# EAGLE design Natcar (EAGLE 8.3.2)
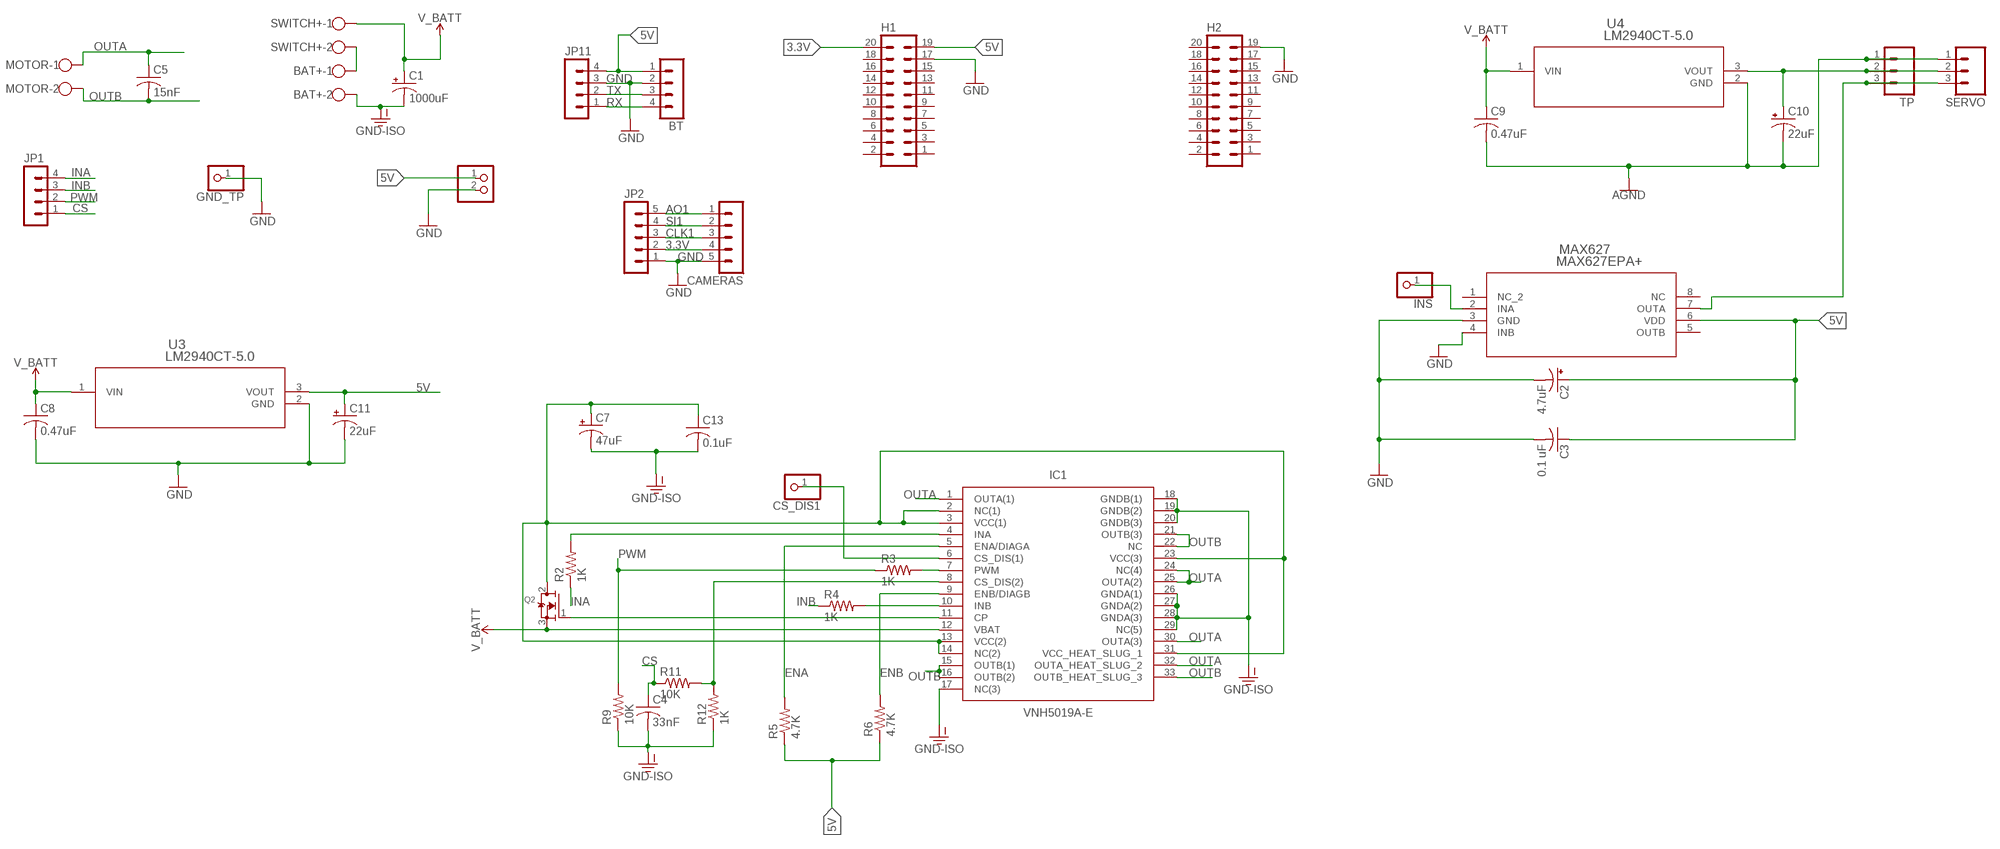
[diagram p0: schematic, sheet 1]

## Parts
BAT+  W237-102  [W237-102]
BT  MA04-1  [MA04-1]
C1  1000uF  CPOL-USE5-10.5  [E5-10,5]
C2  4.7uF  CPOL-USE2-5  [E2-5]
C3  0.1 uF  C-US025-030X050  [C025-030X050]
C4  33nF  C-US025-030X050  [C025-030X050]
C5  15nF  C-US025-030X050  [C025-030X050]
C7  47uF  CPOL-USE2.5-5  [E2,5-5]
C8  0.47uF  C-US025-030X050  [C025-030X050]
C9  0.47uF  C-US025-030X050  [C025-030X050]
C10  22uF  CPOL-USE2.5-5  [E2,5-5]
C11  22uF  CPOL-USE2.5-5  [E2,5-5]
C13  0.1uF  C-US025-030X050  [C025-030X050]
CAMERAS  MA05-1  [MA05-1]
CS_DIS1  PINHD-1X1  [1X01]
GND_TP  PINHD-1X1  [1X01]
H1  MA10-2  [MA10-2]
H2  MA10-2  [MA10-2]
IC1  VNH5019A-E  [VNH5019A-E_1]
INS  PINHD-1X1  [1X01]
JP1  MA04-1  [MA04-1]
JP2  MA05-1  [MA05-1]
JP11  MA04-1  [MA04-1]
JP12  PINHD-1X2  [1X02]
MAX627  MAX627EPA+  [21-0043D_8]
MOTOR  W237-102  [W237-102]
Q2  MOSFET-NGDS_TO220V  [TO220V]
R2  1K  R-US_0309/10  [0309/10]
R3  1K  R-US_0309/10  [0309/10]
R4  1K  R-US_0309/10  [0309/10]
R5  4.7K  R-US_0309/10  [0309/10]
R6  4.7K  R-US_0309/10  [0309/10]
R9  10K  R-US_0309/10  [0309/10]
R11  10K  R-US_0309/10  [0309/10]
R12  1K  R-US_0309/10  [0309/10]
SERVO  MA03  [03P]
SWITCH+  W237-102  [W237-102]
TP  MA03  [03P]
U3  LM2940CT-5.0  [T03B]
U4  LM2940CT-5.0  [T03B]

## Nets
3.3V: CAMERAS.4 H1.20 JP2.2
5V: BT.1 C2.+ C3.1 C11.+ H1.19 JP11.4 JP12.1 MAX627.6(VDD) R5.1 R6.1 U3.3(VOUT)
AGND: C9.2 C10.- SERVO.1 TP.1 U4.2(GND)
AO1: CAMERAS.1 JP2.5
CLK1: CAMERAS.3 JP2.3
CS: C4.1 JP1.1 R11.1
ENA: IC1.5(ENA/DIAGA) R5.2
ENB: IC1.9(ENB/DIAGB) R6.2
GND: BT.2 C2.- C3.2 C8.2 C11.- CAMERAS.5 GND_TP.1 H1.17 H2.19 JP2.1 JP11.3 JP12.2 MAX627.3(GND) MAX627.4(INB) U3.2(GND)
GND-ISO: BAT+.2 C1.- C4.2 C7.- C13.2 IC1.17(NC(3)) IC1.18(GNDB(1)) IC1.19(GNDB(2)) IC1.20(GNDB(3)) IC1.26(GNDA(1)) IC1.27(GNDA(2)) IC1.28(GNDA(3)) IC1.29(NC(5)) R9.1 R12.1
INA: JP1.4 R2.1
INB: JP1.3 R4.1
N$4: BAT+.1 SWITCH+.2
N$12: IC1.11(CP) Q2.1(G)
N$13: IC1.10(INB) R4.2
N$14: C7.+ C13.1 IC1.2(NC(1)) IC1.3(VCC(1)) IC1.13(VCC(2)) IC1.14(NC(2)) IC1.23(VCC(3)) IC1.31(VCC_HEAT_SLUG_1) Q2.2(D)
N$15: IC1.4(INA) R2.2
N$16: CS_DIS1.1 IC1.6(CS_DIS(1))
N$17: IC1.7(PWM) R3.2
N$20: INS.1 MAX627.2(INA)
N$21: MAX627.7(OUTA) SERVO.3 TP.3
N$22: IC1.8(CS_DIS(2)) R11.2 R12.2
N$70: C10.+ SERVO.2 TP.2 U4.3(VOUT)
OUTA: C5.1 IC1.1(OUTA(1)) IC1.24(NC(4)) IC1.25(OUTA(2)) IC1.30(OUTA(3)) IC1.32(OUTA_HEAT_SLUG_2) MOTOR.1
OUTB: C5.2 IC1.15(OUTB(1)) IC1.16(OUTB(2)) IC1.21(OUTB(3)) IC1.22(NC) IC1.33(OUTB_HEAT_SLUG_3) MOTOR.2
PWM: JP1.2 R3.1 R9.2
RX: BT.4 JP11.1
SI1: CAMERAS.2 JP2.4
TX: BT.3 JP11.2
V_BATT [Power]: C1.+ C8.1 C9.1 IC1.12(VBAT) Q2.3(S) SWITCH+.1 U3.1(VIN) U4.1(VIN)
Unconnected: H1.1 H1.2 H1.3 H1.4 H1.5 H1.6 H1.7 H1.8 H1.9 H1.10 H1.11 H1.12 H1.13 H1.14 H1.15 H1.16 H1.18 H2.1 H2.2 H2.3 H2.4 H2.5 H2.6 H2.7 H2.8 H2.9 H2.10 H2.11 H2.12 H2.13 H2.14 H2.15 H2.16 H2.17 H2.18 H2.20 MAX627.1(NC_2) MAX627.5(OUTB) MAX627.8(NC)

## Library data of the parts
BAT+ MOTOR SWITCH+ = con-wago-500:W237-102: WAGO SCREW CLAMP; MPN: 237-102; OC_FARNELL: unknown; OC_NEWARK: 70K9898
BT JP1 JP11 = con-lstb:MA04-1: PIN HEADER; OC_FARNELL: unknown; OC_NEWARK: unknown
C1 C2 C7 C10 C11 = adafruit:CPOL-US: POLARIZED CAPACITOR, American symbol
C3 = adafruit:C-US: CAPACITOR, American symbol
C4 C5 C8 C9 C13 = rcl:C-US: CAPACITOR, American symbol
CAMERAS JP2 = con-lstb:MA05-1: PIN HEADER; OC_FARNELL: unknown; OC_NEWARK: unknown
CS_DIS1 GND_TP INS = adafruit:PINHD-1X1: Pin header 1x1 for 0.1" spacing With round pins
H1 H2 = con-lstb:MA10-2: PIN HEADER; OC_FARNELL: unknown; OC_NEWARK: unknown
IC1 = VNH5019A-E:VNH5019A-E: H-Bridge Motor Driver 30A Auto PowerSO30 STMicroelectronics VNH5019A-E Motor Driver,, H-Bridge Motor Driver, 30-Pin MultiPowerSO <https://componentsearchengine.com/Images/1/VNH5019A-E.JPG> Source: Datasheet <http://docs-europe.electrocomponents.com/webdocs/140d/0900766b8140dac2.pdf>; DESCRIPTION: H-Bridge Motor Driver 30A Auto PowerSO30 STMicroelectronics VNH5019A-E Motor Driver,, H-Bridge Motor Driver, 30-Pin MultiPowerSO; HEIGHT: mm; MANUFACTURER_NAME: STMicroelectronics; MANUFACTURER_PART_NUMBER: VNH5019A-E; RS_PART_NUMBER: 8805550P; SUPPLIER_NAME: RS
JP12 = pinhead:PINHD-1X2: PIN HEADER
MAX627 = max627epa:MAX627EPA+; MANUFACTURER_PART_NUMBER: MAX627EPA+; VENDOR: Maxim Integrated Products
Q2 = adafruit:MOSFET-N: N-Channel Mosfet 2N7002E - 60V 260mA SOT23 [Digikey: 2N7002ET1GOSTR-ND] - REEL BSH103 - 30V 850mA SOT23 [Digikey: 568-5013-1-ND]
R2-R6 R9 R11 R12 = adafruit:R-US_: RESISTOR, American symbol
SERVO TP = con-amp-quick:MA03: AMP QUICK CONNECTOR; OC_FARNELL: unknown; OC_NEWARK: unknown
U3 U4 = lm2940ct:LM2940CT-5.0; MANUFACTURER_PART_NUMBER: LM2940CT5.0; VENDOR: Texas Instruments

## Net classes
0 Control: width 0.254 mm, drill 0.508 mm, clearance 0.305 mm
1 Power: width 0.508 mm, drill 0.508 mm, clearance 0.305 mm

## Board
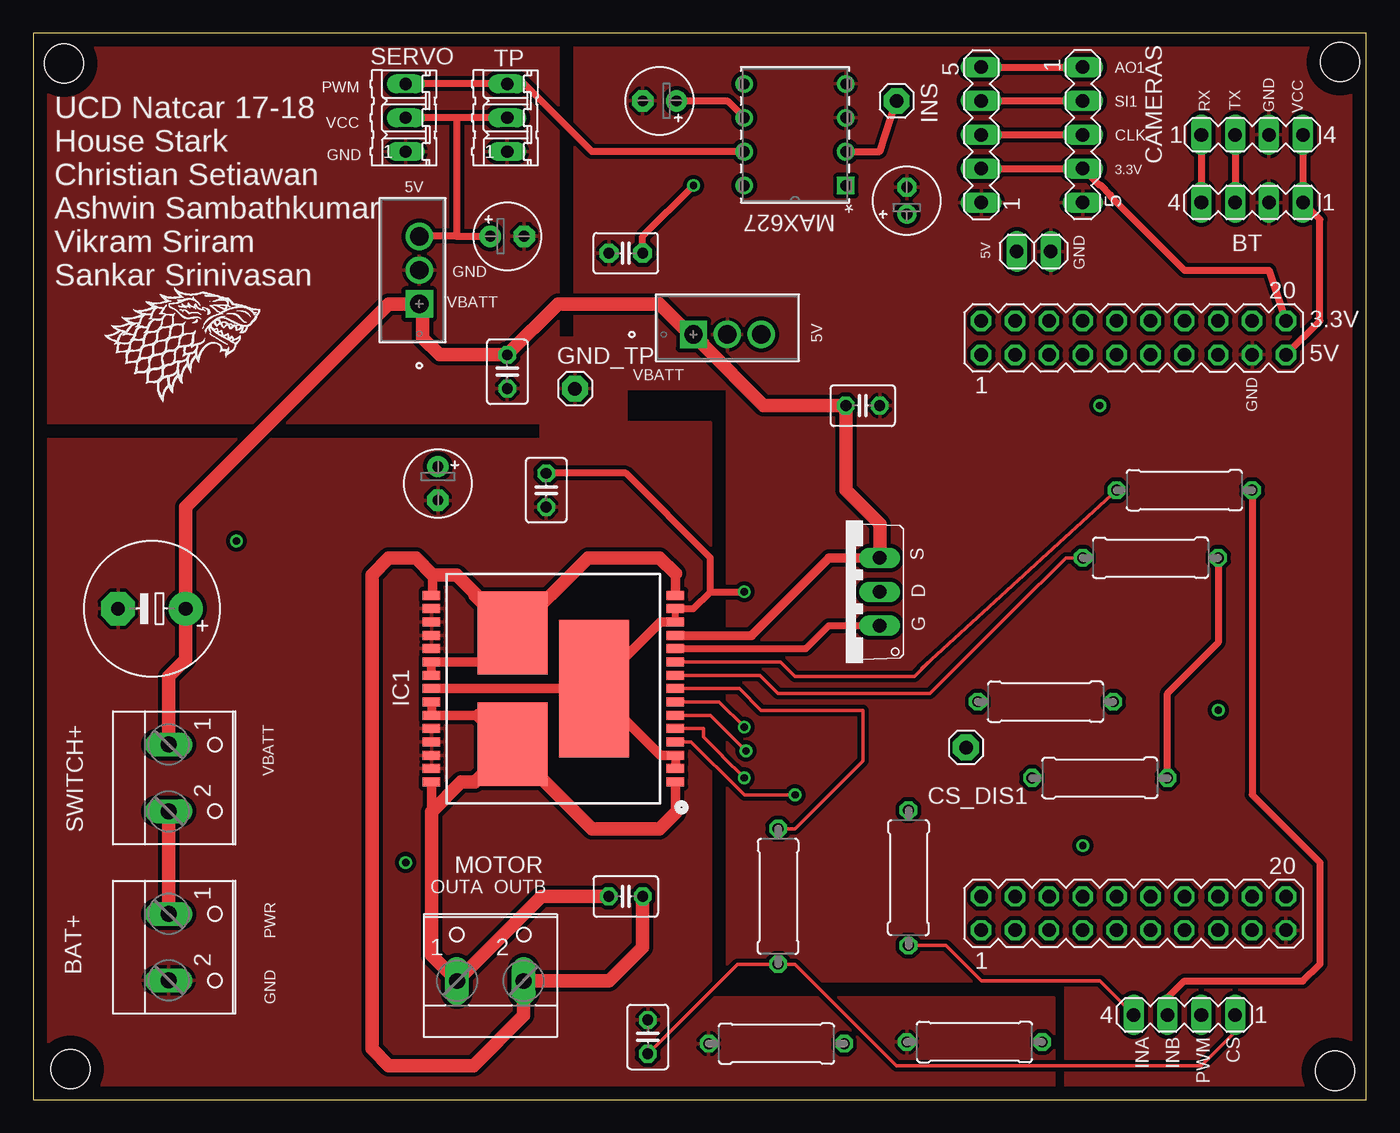
[diagram p1: board, top side]
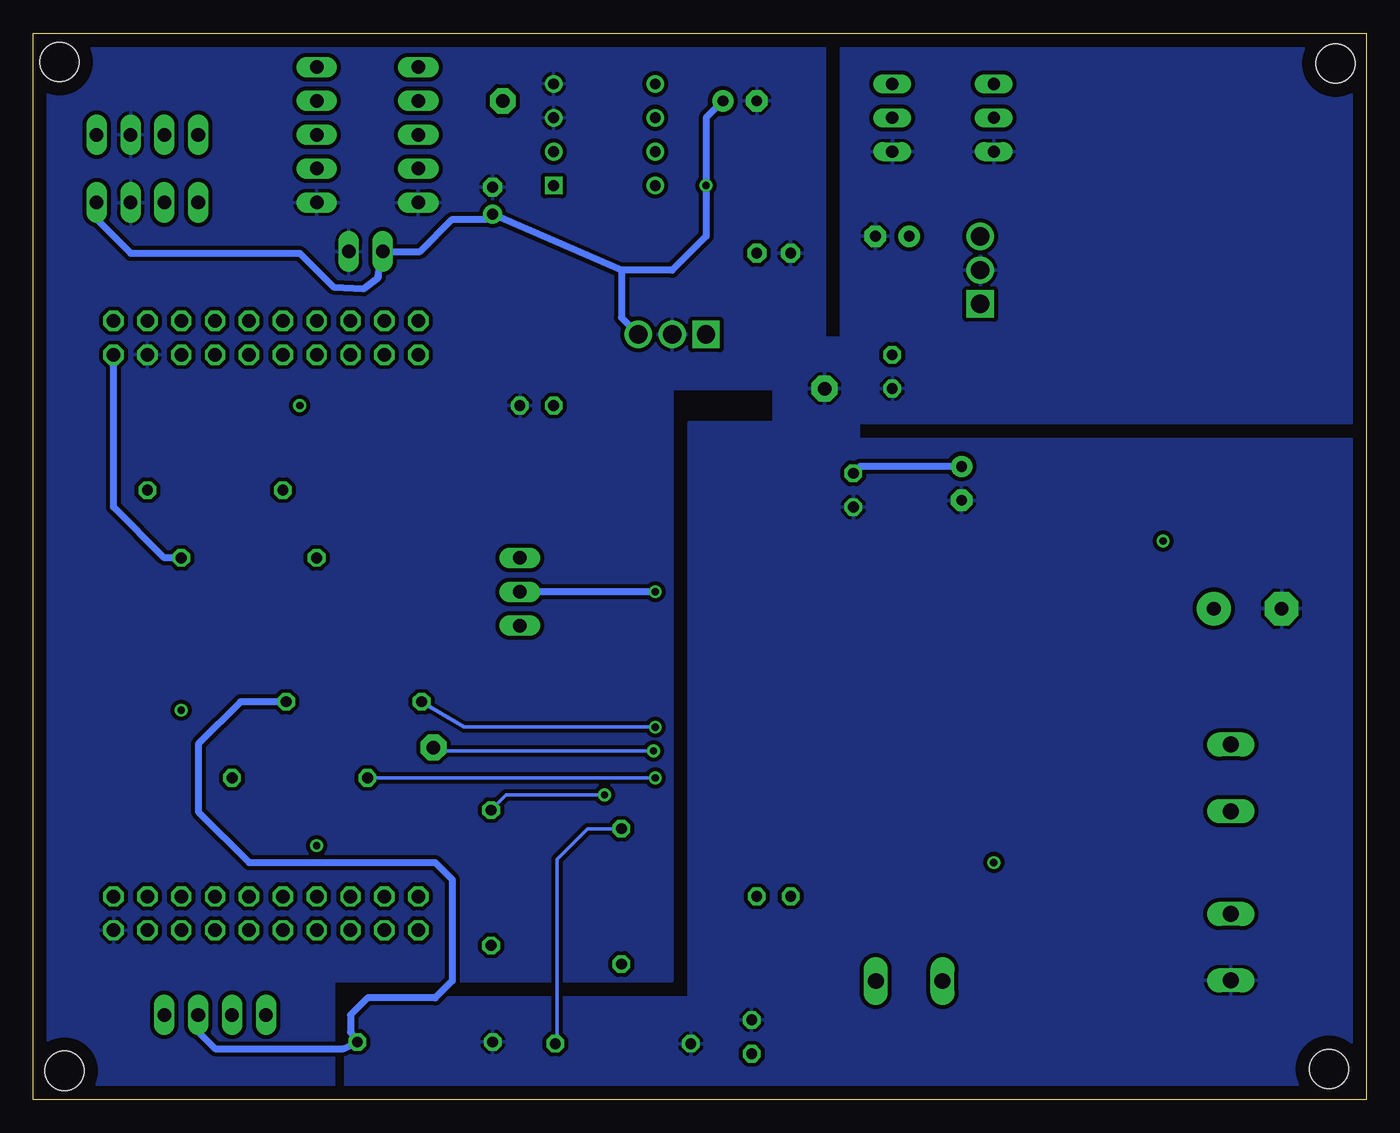
[diagram p2: board, bottom side, seen from below]

Size 100 x 80 mm. Coordinates in mm from the lower left corner, seen from the top.
Outline: 0,0 100,0 100,80 0,80 0,0
Copper layers (1*16): Top 0.035mm / dielectric 1.5mm / Bottom 0.035mm
Design rules "default *": minimum track width 10mil, minimum drill 0.35mm, track to track 6mil, track to pad 6mil, pad to pad 6mil, via to via 6mil, smd to smd 6mil, copper to edge 40mil, drill to drill 6mil, minimum pad ring 10mil, minimum via ring 8mil, stop-mask expansion 4mil, vias tented up to drill 0mil, thermal gap 10mil
Holes 2.95 mm at 2.29,77.72 2.79,2.29 98.04,77.85 97.66,2.16

### Footprints (pad centres in the part's own frame; a part is rotated, then mirrored left to right if it is on the bottom)
W237-102 = drill 1.194 long: 1 -2.5,-1.27; 2 2.5,-1.27
MA04-1 = drill 1.016 long: 1 -3.81,0; 2 -1.27,0; 3 1.27,0; 4 3.81,0
E5-10,5 = drill 1.016 pad 2.54: + -2.54,0 | drill 1.016 pad 2.54 octagon: - 2.54,0
E2-5 = drill 0.813 pad 1.422: + -1.016,0 | drill 0.813 pad 1.422 octagon: - 1.016,0
C025-030X050 = drill 0.813 pad 1.422 octagon: 1 -1.27,0; 2 1.27,0
C025-030X050' = drill 0.813 octagon: 1 -1.27,0; 2 1.27,0
E2,5-5 = drill 0.813 pad 1.6: + -1.27,0 | drill 0.813 pad 1.6 octagon: - 1.27,0
MA05-1 = drill 1.016 long: 1 -5.08,0; 2 -2.54,0; 3 0,0; 4 2.54,0; 5 5.08,0
1X01 = drill 1.016 pad 1.93 octagon: 1 0,0
MA10-2 = drill 1.016 octagon: 1 -11.43,-1.27; 2 -11.43,1.27; 3 -8.89,-1.27; 4 -8.89,1.27; 5 -6.35,-1.27; 6 -6.35,1.27; 7 -3.81,-1.27; 8 -3.81,1.27; 9 -1.27,-1.27; 10 -1.27,1.27; 11 1.27,-1.27; 12 1.27,1.27; 13 3.81,-1.27; 14 3.81,1.27; 15 6.35,-1.27; 16 6.35,1.27; 17 8.89,-1.27; 18 8.89,1.27; 19 11.43,-1.27; 20 11.43,1.27
VNH5019A-E_1 = smd 0.68 x 1.3: 1 -13,-15.15; 2 -12,-15.15; 3 -11,-15.15; 4 -10,-15.15; 5 -9,-15.15; 6 -8,-15.15; 7 -7,-15.15; 8 -6,-15.15; 9 -5,-15.15; 10 -4,-15.15; 11 -3,-15.15; 12 -2,-15.15; 13 -1,-15.15; 14 0,-15.15; 15 1,-15.15; 16 1,3.15; 17 0,3.15; 18 -1,3.15; 19 -2,3.15; 20 -3,3.15; 21 -4,3.15; 22 -5,3.15; 23 -6,3.15; 24 -7,3.15; 25 -8,3.15; 26 -9,3.15; 27 -10,3.15; 28 -11,3.15; 29 -12,3.15; 30 -13,3.15 | smd 10.3 x 5.25: 31 -6,-9.05 | smd 6.23 x 5.25: 32 -10.165,-2.95; 33 -1.835,-2.95
1X02 = drill 1.016 long: 1 -1.27,0; 2 1.27,0
21-0043D_8 = drill 0.813 pad 1.321 square: 1 -7.62,7.62 | drill 0.813 pad 1.321: 2 -7.62,5.08; 3 -7.62,2.54; 4 -7.62,0; 5 0,0; 6 0,2.54; 7 0,5.08; 8 0,7.62
TO220V = drill 1.016 long: 1 -2.54,-2.54; 2 0,-2.54; 3 2.54,-2.54
0309/10 = drill 0.813 octagon: 1 -5.08,0; 2 5.08,0
03P = drill 0.914 long: 1 -2.54,0; 2 0,0; 3 2.54,0
T03B = drill 1.372 pad 1.88 square: 1 -5.08,-1.016 | drill 1.372 pad 1.88: 2 -2.54,-1.016; 3 0,-1.016

### Placement (x,y rotation side)
BAT+  11.43,11.43 270 top
BT  91.44,67.31 180 top
C1  8.89,36.83 180 top
C2  65.53,67.44 90 top
C3  44.45,63.5 180 top
C4  33nF  [C025-030X050']  46.1,4.7 90 top
C5  15nF  [C025-030X050']  44.45,15.24 0 top
C7  30.35,46.23 270 top
C8  0.47uF  [C025-030X050']  62.23,52.07 0 top
C9  0.47uF  [C025-030X050']  35.56,54.61 270 top
C10  35.56,64.77 0 top
C11  46.99,74.93 180 top
C13  0.1uF  [C025-030X050']  38.48,45.72 270 top
CAMERAS  78.74,72.39 270 top
CS_DIS1  69.98,26.42 0 top
GND_TP  40.64,53.34 0 top
H1  82.55,57.15 0 top
H2  82.55,13.97 0 top
IC1  33.02,36.83 90 top
INS  64.77,74.93 0 top
JP1  86.36,6.35 180 top
JP2  71.12,72.39 90 top
JP11  91.44,72.39 0 top
JP12  75.06,63.63 0 top
MAX627  53.34,76.2 180 top
MOTOR  34.29,10.16 0 top
Q2  60.96,38.1 90 top
R2  65.66,16.64 90 top
R3  75.95,29.84 180 top
R4  86.36,45.72 180 top
R5  80.01,24.13 180 top
R6  83.82,40.64 180 top
R9  70.61,4.32 0 top
R11  55.88,15.24 90 top
R12  55.75,4.19 0 top
SERVO  27.94,73.66 90 top
SWITCH+  11.43,24.13 270 top
TP  35.56,73.66 90 top
U3  54.61,58.42 0 top
U4  27.94,64.77 90 top

### Tracks (layer width: path | path; a pad name or v marks a point on that pad's centre or on a via)
3.3V
  Top 0.508: JP2.2 CAMERAS.4 79.96,68.63 80.05,68.63 80.82,67.86 80.82,67.77 86.36,62.23 92.71,62.23 H1.20
5V  (via drill 0.55)
  Top 0.508: C11.+ 52.07,74.93 MAX627.6 | C3.1 45.72,64.77 v49.53,68.58 | JP11.4 BT.1 96.52,66.04 96.52,58.42 H1.19 | R5.1 85.09,30.48 88.9,34.29 R6.1
  Bottom 0.508: C11.+ 49.53,73.66 v49.53,68.58 49.53,64.77 52.07,62.23 55.88,62.23 | 55.88,62.23 C2.+ 65.91,66.04 68.58,66.04 70.99,63.63 JP12.1 74.12,61.77 74.12,61.68 75.22,60.83 77.47,60.96 80.01,63.5 92.71,63.5 95.25,66.04 BT.1 | 55.88,62.23 55.88,58.67 U3.3 | R6.1 90.17,40.64 93.98,44.45 H1.19
AGND
  pour Top: 0,82.55 39.37,82.55 39.37,59.69 39.37,57.15 44.45,57.15 44.45,50.8 -1.27,50.8 -1.27,82.55
  pour Bottom: -1.27,82.55 39.37,82.55 39.37,57.15 44.45,57.15 44.45,50.8 -1.27,50.8
AO1
  Top 0.508: JP2.5 CAMERAS.1
CLK1
  Top 0.508: JP2.3 CAMERAS.3
CS
  Top 0.254: C4.1 52.83,10.16 R11.1 57.15,10.16 64.77,2.54 87.63,2.54 90.17,5.08 JP1.1
ENA  (via drill 0.55)
  Top 0.254: IC1.5 50.27,27.83 50.27,27.21 51.71,25.78 51.71,25.76 v53.34,24.13
  Bottom 0.254: v53.34,24.13 R5.2
ENB
  Top 0.254: R6.2 77.47,40.64 73.58,36.75 72.92,36.12 67.28,30.48 55.88,30.48 54.53,31.83 IC1.9
GND
  pour Top: 40.64,82.55 40.64,57.15 38.1,57.15 38.1,50.8 44.45,50.8 44.45,53.34 52.07,53.34 52.07,8.89 77.47,8.89 77.47,-1.27 101.6,-1.27 101.6,82.55
  pour Bottom: 40.64,82.55 40.64,57.15 38.1,57.15 38.1,50.8 44.45,50.8 44.45,53.34 52.07,53.34 52.07,8.89 77.47,8.89 77.47,-1.27 101.6,-1.27 101.6,82.55
GND-ISO
  pour Top: -1.27,49.53 38.1,49.53 38.1,57.15 44.45,57.15 44.45,50.8 50.8,50.8 50.8,7.62 76.58,7.62 76.58,-1.4 -1.27,-1.4
  pour Bottom: -1.27,49.53 38.1,49.53 38.1,57.15 44.45,57.15 44.45,50.8 50.8,50.8 50.8,7.62 76.58,7.62 76.58,-1.4 -1.27,-1.4
INA
  Top 0.254: R2.1 68.45,11.56 71.12,8.89 80.01,8.89 JP1.4
INB
  Top 0.508: R4.1 91.44,22.86 96.52,17.78 96.52,10.16 95.25,8.89 86.36,8.89 85.09,7.62 JP1.3
N$1  (via drill 0.55)
  other vias: 27.94,17.78
N$2  (via drill 0.55)
  other vias: 15.24,41.91
N$4
  Top 1.016: BAT+.1 SWITCH+.2
N$8  (via drill 0.55)
  other vias: 88.9,29.21
N$9  (via drill 0.55)
  other vias: 78.74,19.05
N$12
  Top 0.508: IC1.11 57.96,33.83 59.69,35.56 Q2.1
N$13
  Top 0.254: IC1.10 53.34,32.83 | 53.34,32.83 53.53,32.83 | 67.34,32.99 66.67,32.38 | 67.34,32.99 R4.2 | 53.34,32.83 56.07,32.83 57.15,31.75 66.1,31.75 67.34,32.99
N$14  (via drill 0.55)
  Top 0.508: IC1.13 IC1.14 49.53,36.83 50.8,38.1 | 50.8,38.1 v53.34,38.1 | 50.8,38.1 50.8,40.64 44.45,46.99 C13.1
  Top 0.66: IC1.3 IC1.2
  Top 0.711: IC1.13 47.07,35.83 | IC1.23 IC1.31 | 47.07,25.83 IC1.3
  Top 0.762: 47.07,35.83 IC1.31 47.07,25.83
  Bottom 0.508: v53.34,38.1 Q2.2 | C7.+ 37.97,47.5 C13.1
N$15  (via drill 0.55)
  Top 0.254: IC1.4 49.35,26.83 52.96,23.22 52.98,23.22 53.34,22.86 v57.15,22.86
  Bottom 0.254: v57.15,22.86 64.52,22.86 R2.2
N$16  (via drill 0.55)
  Top 0.254: IC1.6 50.8,28.83 v53.47,26.16
  Bottom 0.254: v53.47,26.16 69.72,26.16 CS_DIS1.1
N$17  (via drill 0.55)
  Top 0.254: IC1.7 51.45,29.83 v53.34,27.94
  Bottom 0.254: v53.34,27.94 67.69,27.94 R3.2
N$19  (via drill 0.55)
  other vias: 80.01,52.07
N$20
  Top 0.508: MAX627.2 63.5,71.12 INS.1
N$21
  Top 0.508: SERVO.3 TP.3 36.83,76.2 41.91,71.12 MAX627.7
N$22
  Top 0.254: IC1.8 52.99,30.83 54.61,29.21 62.23,29.21 62.23,25.4 57.15,20.32 R11.2
  Bottom 0.254: R11.2 58.42,20.32 60.71,18.03 60.71,4.32 R12.2
N$70
  Top 0.508: TP.2 31.75,73.66 | 31.75,73.66 SERVO.2 | 31.75,64.77 U4.3 | 31.75,64.77 C10.+ | 31.75,73.66 31.75,64.77
OUTA
  Top 0.66: IC1.24 IC1.25
  Top 0.711: 29.87,21.59 IC1.30 | IC1.25 33.4,28.83 | IC1.1 48.17,21.5
  Top 1.016: 35.77,26.46 33.13,23.83 32.11,23.83 29.87,21.59 29.87,10.81 MOTOR.1 38.14,15.24 C5.1 | 35.77,26.46 IC1.32 | 33.4,28.83 35.77,26.46 | 48.17,21.5 46.99,20.32 41.91,20.32 35.77,26.46
OUTB
  Top 0.66: IC1.22 IC1.21
  Top 0.711: IC1.15 48.17,39.46 | IC1.21 33.8,32.83 | 29.97,39.37 29.97,37.93 IC1.16 | 33.13,37.83 33.13,37.98
  Top 1.016: IC1.33 33.13,37.83 | 48.17,39.46 46.99,40.64 41.62,40.64 IC1.33 | 33.8,32.83 IC1.33 | 33.13,37.98 31.75,39.37 29.97,39.37 28.7,40.64 26.67,40.64 25.4,39.37 25.4,3.81 26.67,2.54 33.02,2.54 36.79,6.31 MOTOR.2 43.18,8.89 45.72,11.43 C5.2
PWM
  Bottom 0.508: R3.1 84.45,29.84 87.63,26.67 87.63,21.59 83.82,17.78 69.85,17.78 68.58,16.51 68.58,8.89 69.85,7.62 74.93,7.62 76.2,6.35 76.2,5.08 R9.2 76.71,3.81 86.36,3.81 87.63,5.08 JP1.2
RX
  Top 0.508: JP11.1 BT.4
SI1
  Top 0.508: JP2.4 CAMERAS.2
TX
  Top 0.508: JP11.2 BT.3
V_BATT
  Top 0.66: IC1.12 53.88,34.83
  Top 0.711: 53.88,34.83 59.69,40.64 Q2.3
  Top 1.016: SWITCH+.1 10.16,31.75 11.43,33.02 C1.+ 11.43,44.45 26.67,59.69 U4.1 29.21,59.44 29.21,57.15 30.48,55.88 C9.1 39.37,59.69 46.99,59.69 49.28,57.4 U3.1 50.23,56.71 50.23,56.64 54.8,52.07 C8.1 60.96,45.72 63.5,43.18 Q2.3

### Text on the board
tNames: AO1 | GND | VCC | PWM | RX | TX | VCC | SI1 | CLK | GND | 5V | 3.3V | GND | 5V | GND | UCD Natcar 17-18 / House Stark / Christian Setiawan / Ashwin Sambathkumar / Vikram Sriram / Sankar Srinivasan | VBATT | 5V | VBATT | 3.3V / 5V | GND | S | D | G | VBATT | OUTA OUTB | PWR | GND | INA / INB / PWM / CS